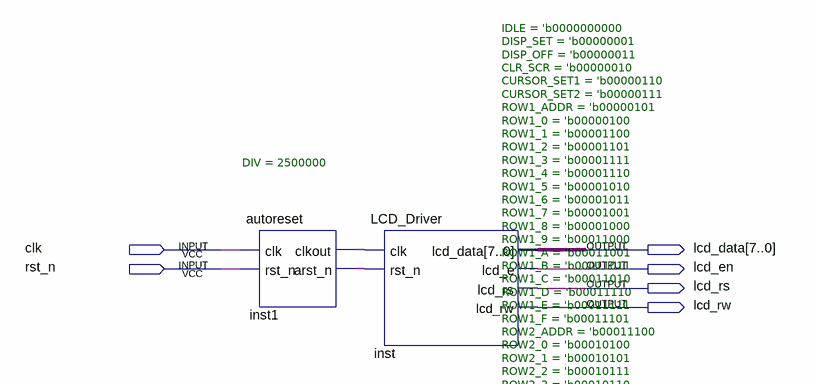
[diagram p0: schematic sheet]
// Quartus schematic LCD1602.bdf as structural Verilog: 2 symbols, 6 pins
module LCD1602 (
  input  clk,
  input  rst_n,
  output [7:0] lcd_data,
  output lcd_en,
  output lcd_rs,
  output lcd_rw
);

  wire inst1_arst_n, inst1_clkout;

  autoreset #(.DIV(2500000)) inst1 (.clk(clk), .rst_n(rst_n), .clkout(inst1_clkout), .arst_n(inst1_arst_n));
  LCD_Driver #(.IDLE('b0000000000), .DISP_SET('b00000001), .DISP_OFF('b00000011), .CLR_SCR('b00000010), .CURSOR_SET1('b00000110), .CURSOR_SET2('b00000111), .ROW1_ADDR('b00000101), .ROW1_0('b00000100), .ROW1_1('b00001100), .ROW1_2('b00001101), .ROW1_3('b00001111), .ROW1_4('b00001110), .ROW1_5('b00001010), .ROW1_6('b00001011), .ROW1_7('b00001001), .ROW1_8('b00001000), .ROW1_9('b00011000), .ROW1_A('b00011001), .ROW1_B('b00011011), .ROW1_C('b00011010), .ROW1_D('b00011110), .ROW1_E('b00011111), .ROW1_F('b00011101), .ROW2_ADDR('b00011100), .ROW2_0('b00010100), .ROW2_1('b00010101), .ROW2_2('b00010111), .ROW2_3('b00010110), .ROW2_4('b00010010), .ROW2_5('b00010011), .ROW2_6('b00010001), .ROW2_7('b00010000), .ROW2_8('b00110000), .ROW2_9('b00110001), .ROW2_A('b00110011), .ROW2_B('b00110010), .ROW2_C('b00110110), .ROW2_D('b00110111), .ROW2_E('b00110101), .ROW2_F('b00110100), .CLEAR('b0000000001), .SETMODE('b0000000011), .SWITCHMODE('b0000000100), .SETFUNCTION('b0000000101), .SETDDRAM1('b0000000110), .SETDDRAM2('b0000000111), .WRITERAM1('b0000001000), .WRITERAM2('b0000001001), .WAIT('b1000001001), .init('b00), .write_data_1('b01), .write_data_2('b10)) inst (
    .clk(inst1_clkout), .rst_n(inst1_arst_n), .lcd_data(lcd_data), .lcd_e(lcd_en), .lcd_rs(lcd_rs),
    .lcd_rw(lcd_rw));
endmodule
